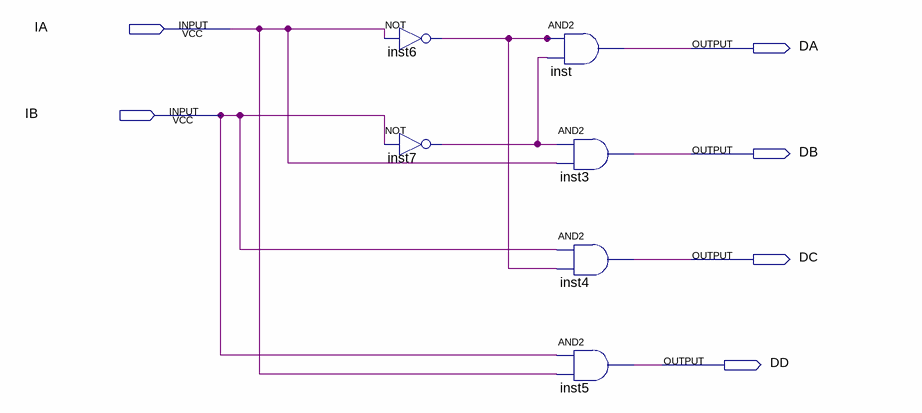
[diagram p0: schematic sheet]
// Quartus schematic Decoder.bdf as structural Verilog: 6 symbols, 6 pins
module Decoder (
  input  IA,
  input  IB,
  output DA,
  output DB,
  output DC,
  output DD
);

  wire inst6_out, inst7_out;

  not inst6 (inst6_out, IA);
  not inst7 (inst7_out, IB);
  and inst (DA, inst6_out, inst7_out);
  and inst3 (DB, inst7_out, IA);
  and inst4 (DC, IB, inst6_out);
  and inst5 (DD, IB, IA);
endmodule
